# EAGLE schematic NV08C_GPS_shield (EAGLE 6.4)
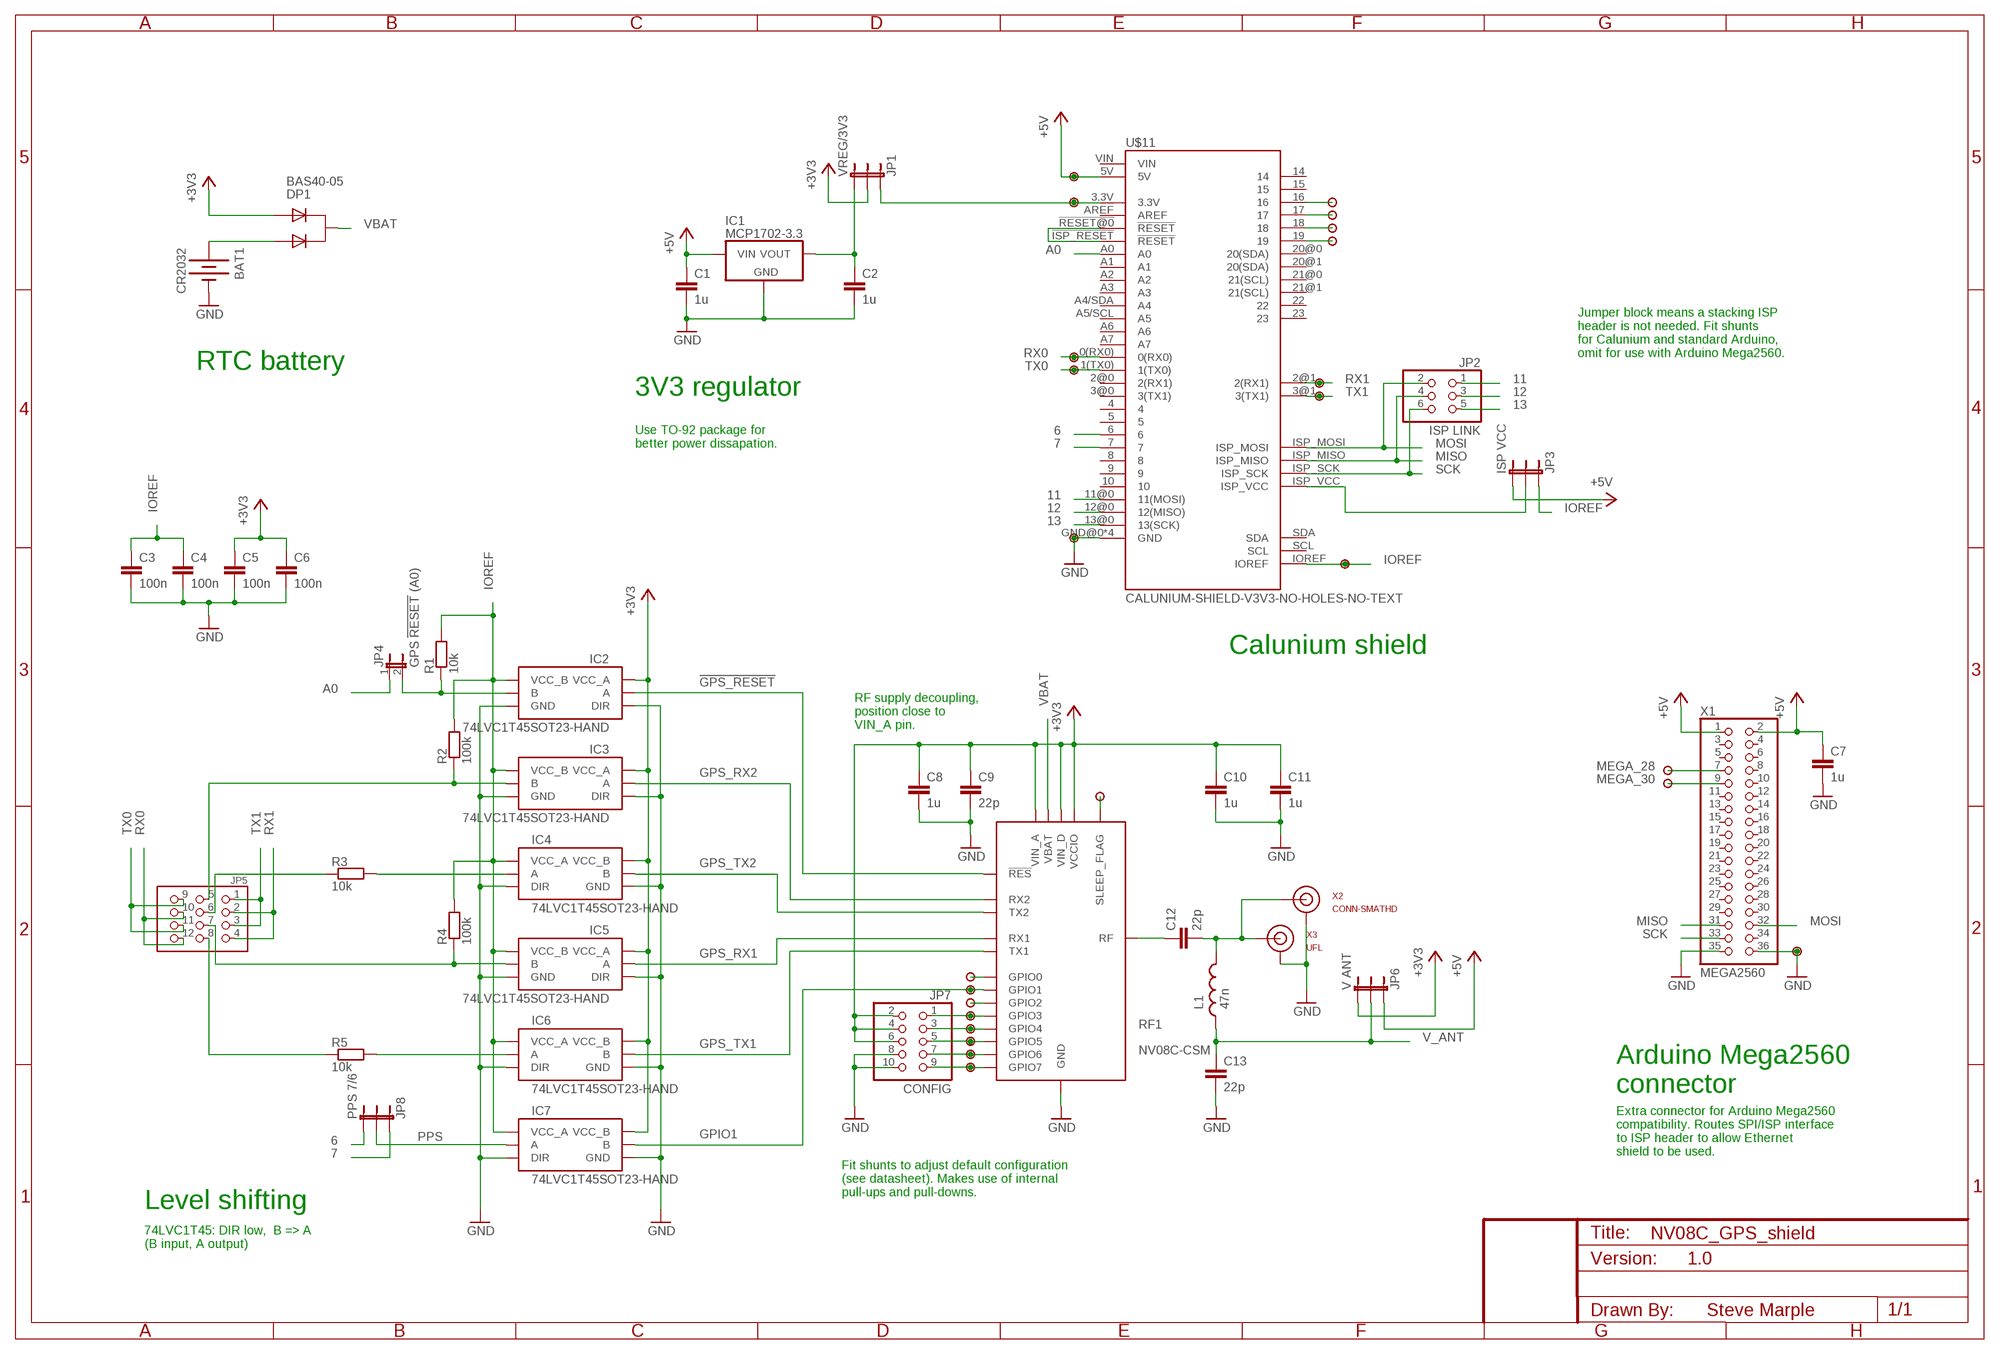
[diagram p0: schematic, sheet 1]

## Parts
BAT1  CR2032  BATTERY20PTH  [BATTCOM_20MM_PTH]
C1  1u  C-EU1206-HAND  [1206-HAND]
C2  1u  C-EU1206-HAND  [1206-HAND]
C3  100n  C-EU1206-HAND  [1206-HAND]
C4  100n  C-EU1206-HAND  [1206-HAND]
C5  100n  C-EU1206-HAND  [1206-HAND]
C6  100n  C-EU1206-HAND  [1206-HAND]
C7  1u  C-EU1206-HAND  [1206-HAND]
C8  1u  C-EU1206-HAND  [1206-HAND]
C9  22p  C-EU0805-HAND  [0805-HAND]
C10  1u  C-EU1206-HAND  [1206-HAND]
C11  1u  C-EU1206-HAND  [1206-HAND]
C12  22p  C-EU0805-HAND  [0805-HAND]
C13  22p  C-EU0805-HAND  [0805-HAND]
DP1  BAS40-05  DIODE-PAIR-COMMON-CATHODE  [SOT23-3-HAND]
IC1  MCP1702-3.3  MCP1702  [TO-92]
IC2  74LVC1T45SOT23-HAND  [SOT23-6-HAND]
IC3  74LVC1T45SOT23-HAND  [SOT23-6-HAND]
IC4  74LVC1T45SOT23-HAND  [SOT23-6-HAND]
IC5  74LVC1T45SOT23-HAND  [SOT23-6-HAND]
IC6  74LVC1T45SOT23-HAND  [SOT23-6-HAND]
IC7  74LVC1T45SOT23-HAND  [SOT23-6-HAND]
JP1  VREG/3V3  JUMPER-3PTH  [1X03]
JP2  ISP LINK  PINHD-2X3  [2X03]
JP3  ISP VCC  JUMPER-3PTH  [1X03]
JP4  GPS !RESET! (A0)  JUMPER-2PTH  [1X02]
JP5  PIN_3X4  [PIN_3X4]
JP6  V ANT  JUMPER-3PTH  [1X03]
JP7  CONFIG  PINHD-2X5  [2X05]
JP8  PPS 7/6  JUMPER-3PTH  [1X03]
L1  47n  INDUCTOR0805-HAND  [0805-HAND]
R1  10k  RESISTOR1206-HAND  [1206-HAND]
R2  100k  RESISTOR1206-HAND  [1206-HAND]
R3  10k  RESISTOR1206-HAND  [1206-HAND]
R4  100k  RESISTOR1206-HAND  [1206-HAND]
R5  10k  RESISTOR1206-HAND  [1206-HAND]
RF1  NV08C-CSM  NV08C-CSMHAND  [NVC08C-CSM-HAND]
U$1  PAD  [PAD]
U$2  PAD  [PAD]
U$3  PAD  [PAD]
U$4  PAD  [PAD]
U$5  PAD  [PAD]
U$6  PAD  [PAD]
U$7  PAD  [PAD]
U$8  PAD  [PAD]
U$9  PAD  [PAD]
U$10  PAD  [PAD]
U$11  CALUNIUM-SHIELD-V3V3-NO-HOLES-NO-TEXT  [CALUNIUM-SHIELD-NO-OUTLINE-NO-HOLES-NO-TEXT-V3]
U$12  PAD  [PAD]
U$13  PAD  [PAD]
U$14  PAD  [PAD]
U$15  PAD  [PAD]
U$16  PAD  [PAD]
U$17  PAD  [PAD]
U$18  PAD  [PAD]
U$19  PAD  [PAD]
U$20  ?  PAD  [PAD]
U$21  PAD  [PAD]
U$22  PAD  [PAD]
U$23  PAD  [PAD]
U$24  PAD  [PAD]
U$25  PAD  [PAD]
X1  MEGA2560  PINHD-2X18  [2X18]
X2  CONN-SMATHD  [SMA-THD]
X3  UFL  CONN-UFLHAND  [CONN-UFL-HAND-SOLDERING]

## Nets
3V3_SHIELD [power]: JP1.1 U$2.1 U$11.3.3V
6: JP8.3 U$11.6
7: JP8.1 U$11.7
11: JP2.1 U$11.11@0(11(MOSI))
12: JP2.3 U$11.12@0(12(MISO))
13: JP2.5 U$11.13@0(13(SCK))
!GPS_RESET: IC2.3(A) RF1.P$25(!RES)
!RESET: U$11.!ISP_RESET(!RESET) U$11.!RESET@0(!RESET)
+3V3 [power]: C5.1 C6.1 C8.1 C9.1 C10.1 C11.1 DP1.2(A2) IC2.1(VCC_A) IC3.1(VCC_A) IC4.6(VCC_B) IC5.1(VCC_A) IC6.6(VCC_B) IC7.6(VCC_B) JP1.2 JP6.3 JP7.2 JP7.4 JP7.6 RF1.P$8(VIN_A) RF1.P$26(VIN_D) RF1.P$28(VCCIO)
+5V [power]: C1.1 C7.1 IC1.2(VIN) JP3.3 JP6.1 U$1.1 U$11.5V X1.1 X1.2
A0: JP4.1 U$11.A0
GND [power]: BAT1.2(-) C1.2 C2.2 C3.2 C4.2 C5.2 C6.2 C7.2 C8.2 C9.2 C10.2 C11.2 C13.2 IC1.1(GND) IC2.2(GND) IC2.5(DIR) IC3.2(GND) IC3.5(DIR) IC4.2(GND) IC4.5(DIR) IC5.2(GND) IC5.5(DIR) IC6.2(GND) IC6.5(DIR) IC7.2(GND) IC7.5(DIR) JP7.8 JP7.10 RF1.P$3(GND) RF1.P$9(GND) RF1.P$10(GND) RF1.P$11(GND) RF1.P$12(GND) RF1.P$13(GND) RF1.P$14(GND) RF1.P$16(GND) RF1.P$17(GND) RF1.P$18(GND) RF1.P$19(GND) RF1.P$22(GND) RF1.P$24(GND) RF1.P$27(GND) RF1.P$29(GND) RF1.P$34(GND) U$11.GND@0(GND) U$11.GND@1(GND) U$11.GND@2(GND) U$11.GND@3(GND) U$12.1 U$17.1 X1.35 X1.36 X2.GND@0(GND) X2.GND@1(GND) X2.GND@2(GND) X2.GND@3(GND) X3.GND@0(GND) X3.GND@1(GND)
GPIO0: RF1.P$20(GPIO0) U$18.1
GPIO1: IC7.4(B) RF1.P$2(GPIO1) U$19.1
GPIO2: RF1.P$1(GPIO2) U$20.1
GPIO3: JP7.1 RF1.P$6(GPIO3) U$21.1
GPIO4: JP7.3 RF1.P$7(GPIO4) U$22.1
GPIO5: JP7.5 RF1.P$4(GPIO5) U$23.1
GPIO6: JP7.7 RF1.P$35(GPIO6) U$24.1
GPIO7: JP7.9 RF1.P$5(GPIO7) U$25.1
GPS_RX1: IC5.3(A) RF1.P$33(RX1)
GPS_RX1_IOREF: IC5.4(B) JP5.7 R4.1
GPS_RX2: IC3.3(A) RF1.P$30(RX2)
GPS_RX2_IOREF: IC3.4(B) JP5.5 R2.1
GPS_TX1: IC6.4(B) RF1.P$32(TX1)
GPS_TX1_IOREF: JP5.8 R5.1
GPS_TX2: IC4.4(B) RF1.P$31(TX2)
GPS_TX2_IOREF: JP5.6 R3.1
IOREF [power]: C3.1 C4.1 IC2.6(VCC_B) IC3.6(VCC_B) IC4.1(VCC_A) IC5.6(VCC_B) IC6.1(VCC_A) IC7.1(VCC_A) JP3.1 R1.2 R2.2 R4.2 U$11.IOREF U$13.1
ISP_VCC [power]: JP3.2 U$11.ISP_VCC
MEGA_28: U$14.1 X1.7
MEGA_30: U$15.1 X1.9
MISO: JP2.4 U$11.ISP_MISO X1.31
MOSI: JP2.2 U$11.ISP_MOSI X1.32
N$1 [power]: C2.1 IC1.3(VOUT) JP1.3
N$2: U$6.1 U$11.19
N$3: IC4.3(A) R3.2
N$4 [antenna]: C12.2 L1.2 X2.SIG(SIGNAL) X3.SIGNAL
N$5: IC6.3(A) R5.2
N$6: U$5.1 U$11.18
N$7 [antenna]: C12.1 RF1.P$15(RF)
N$8: IC2.4(B) JP4.2 R1.1
N$9: U$4.1 U$11.17
N$10: U$3.1 U$11.16
PPS: IC7.3(A) JP8.2
RX0: JP5.10 JP5.12 U$7.1 U$11.0(RX0)
RX1: JP5.2 JP5.4 U$9.1 U$11.2@1(2(RX1))
SCK: JP2.6 U$11.ISP_SCK X1.33
SLEEP_FLAG: RF1.P$21(SLEEP_FLAG) U$16.1
TX0: JP5.9 JP5.11 U$8.1 U$11.1(TX0)
TX1: JP5.1 JP5.3 U$10.1 U$11.3@1(3(TX1))
V_ANT [power]: C13.1 JP6.2 L1.1
VBAT: DP1.3(C) RF1.P$23(VBAT)
VBATT: BAT1.1(+) DP1.1(A1)
Unconnected: U$11.2@0(2(RX1)) U$11.3@0(3(TX1)) U$11.4 U$11.5 U$11.8 U$11.9 U$11.10 U$11.14 U$11.15 U$11.20@0(20(SDA)) U$11.20@1(20(SDA)) U$11.21@0(21(SCL)) U$11.21@1(21(SCL)) U$11.22 U$11.23 U$11.A1 U$11.A2 U$11.A3 U$11.A4/SDA(A4) U$11.A5/SCL(A5) U$11.A6 U$11.A7 U$11.AREF U$11.SCL U$11.SDA U$11.VIN X1.3 X1.4 X1.5 X1.6 X1.8 X1.10 X1.11 X1.12 X1.13 X1.14 X1.15 X1.16 X1.17 X1.18 X1.19 X1.20 X1.21 X1.22 X1.23 X1.24 X1.25 X1.26 X1.27 X1.28 X1.29 X1.30 X1.34

## Notes on the sheet
- Jumper block means a stacking ISP
  header is not needed. Fit shunts
  for Calunium and standard Arduino,
  omit for use with Arduino Mega2560.
- RTC battery
- 3V3 regulator
- Use TO-92 package for
  better power dissapation.
- Calunium shield
- RF supply decoupling,
  position close to
  VIN_A pin.
- Arduino Mega2560
  connector
- Extra connector for Arduino Mega2560
  compatibility. Routes SPI/ISP interface
  to ISP header to allow Ethernet
  shield to be used.
- Fit shunts to adjust default configuration
  (see datasheet). Makes use of internal
  pull-ups and pull-downs.
- Level shifting
- 74LVC1T45: DIR low,  B => A
  (B input, A output)
- 1.0
- Steve Marple

## Library data of the parts
BAT1 = SparkFun:BATTERY: Battery Holders Various common sizes : AA, AAA, 20mm coin cell and 12mm coin cell.
C1-C13 = SteveMarple:C-EU
DP1 = SteveMarple:DIODE-PAIR-COMMON-CATHODE
IC1 = SteveMarple:MCP1702: Microchip MCP1702 250mA low quiescent current (2uA) LDO voltage regulator.
IC2-IC7 = SteveMarple:74LVC1T45
JP1 JP3 JP6 JP8 = SparkFun:JUMPER-3
JP2 = pinhead:PINHD-2X3: PIN HEADER
JP4 = SparkFun:JUMPER-2: Jumper Basic 0.1" spaced jumper. Use with breakaway headers.
JP5 = pinhead_3row:PIN_3X4
JP7 = pinhead:PINHD-2X5: PIN HEADER
L1 = SteveMarple:INDUCTOR: Inductors Basic Inductor/Choke - 0603 and 1206. Footprints are not proven and vary greatly between part numbers.
R1-R5 = SteveMarple:RESISTOR: 1/4W PTH resistor
RF1 = nvs-tech:NV08C-CSM
U$1-U$10 U$12-U$25 = SteveMarple:PAD
U$11 = SteveMarple:CALUNIUM-SHIELD-V3
X1 = pinhead:PINHD-2X18: PIN HEADER
X2 = SteveMarple:CONN-SMA: SMA connector
X3 = SteveMarple:CONN-UFL

## Net classes
1 power: width 0.381 mm
2 antenna: width 0.66 mm